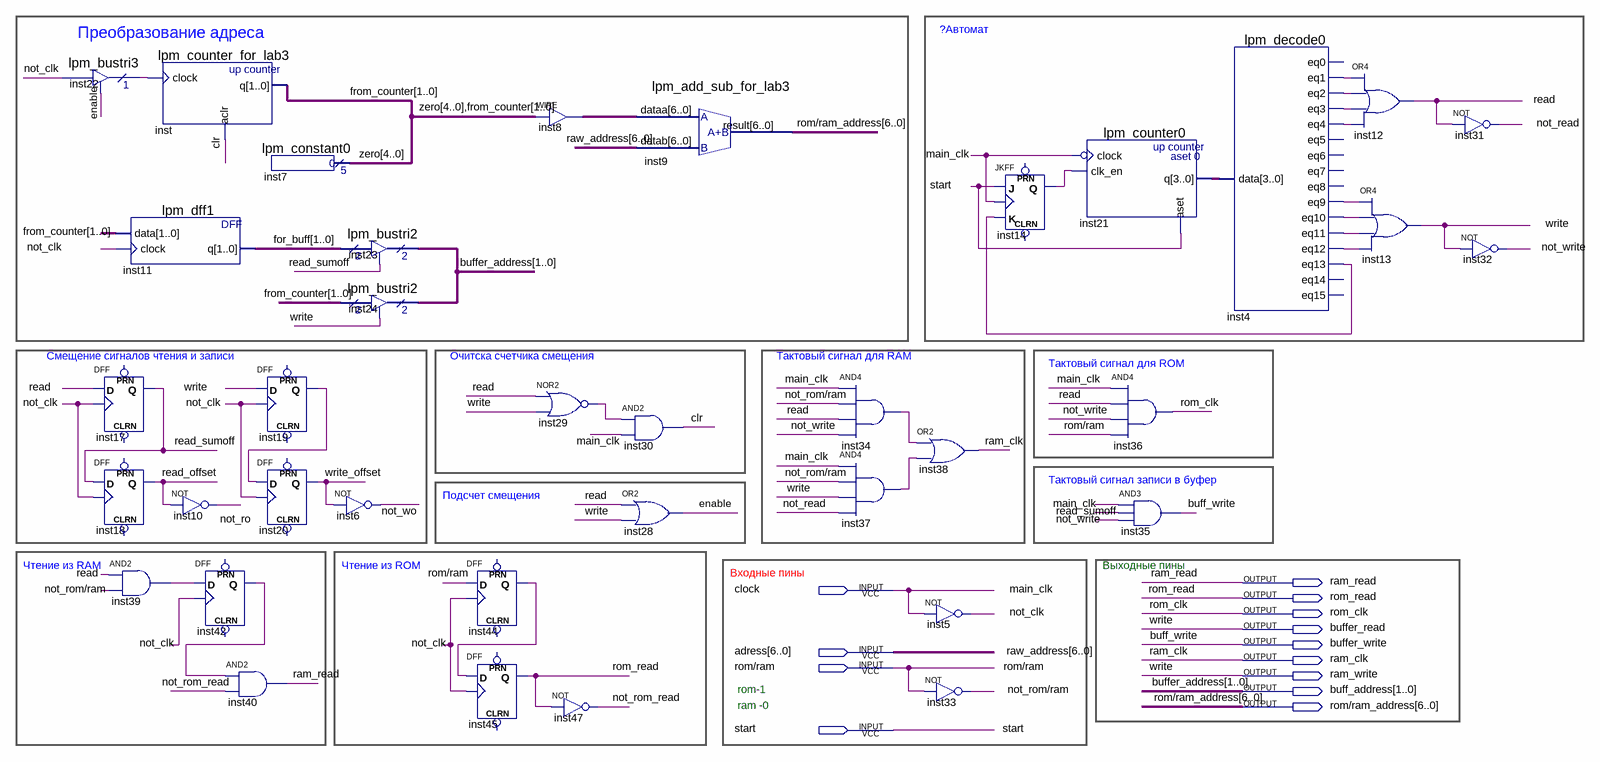
[diagram p0: schematic sheet]
// Quartus schematic new_OI_controller.bdf as structural Verilog: 37 symbols, 13 pins
module new_OI_controller (
  input  clock,
  input  [6:0] adress,
  input  \rom/ram ,
  input  start,
  output ram_read,
  output rom_read,
  output rom_clk,
  output buffer_read,
  output buffer_write,
  output ram_clk,
  output ram_write,
  output [1:0] buff_address,
  output [6:0] \rom/ram_address 
);

  wire clr, enable, inst4_eq1, inst4_eq2, inst4_eq3, inst4_eq4, inst4_eq9, inst4_eq10, inst4_eq11,
       inst4_eq12, inst4_eq13, inst14_q, inst19_q, inst22_tridata, inst29_out, inst34_out, inst37_out,
       inst39_out, inst42_q, inst44_q, not_clk, not_read, not_ro, \not_rom/ram , not_rom_read, not_wo,
       not_write, read, read_offset, read_sumoff, write_offset;
  wire [1:0] for_buff, from_counter;
  wire [3:0] inst21_q;
  wire [4:0] zero;
  wire [6:0] inst8_out;

  lpm_bustri3 inst22 (.enabledt(enable), .data(not_clk), .tridata(inst22_tridata));
  lpm_dff1 inst11 (.data(from_counter), .clock(not_clk), .q(for_buff));
  DFF inst17 (.CLK(not_clk), .D(read), .Q(read_sumoff));  // open: CLRN, PRN
  DFF inst18 (.CLK(not_clk), .D(read_sumoff), .Q(read_offset));  // open: CLRN, PRN
  and inst39 (inst39_out, read, \not_rom/ram );
  lpm_counter_for_lab3 inst (.clock(inst22_tridata), .aclr(clr), .q(from_counter));
  not inst10 (not_ro, read_offset);
  DFF inst42 (.CLK(not_clk), .D(inst39_out), .Q(inst42_q));  // open: CLRN, PRN
  lpm_constant0 inst7 (.result(zero));
  DFF inst19 (.CLK(not_clk), .D(buffer_read), .Q(inst19_q));  // open: CLRN, PRN
  DFF inst20 (.CLK(not_clk), .D(inst19_q), .Q(write_offset));  // open: CLRN, PRN
  and inst40 (ram_read, inst42_q, not_rom_read);
  lpm_bustri2 inst23 (.enabledt(read_sumoff), .data(for_buff), .tridata(buff_address));
  lpm_bustri2 inst24 (.enabledt(buffer_read), .data(from_counter), .tridata(buff_address));
  not inst6 (not_wo, write_offset);
  DFF inst44 (.CLK(not_clk), .D(\rom/ram ), .Q(inst44_q));  // open: CLRN, PRN
  DFF inst45 (.CLK(not_clk), .D(inst44_q), .Q(rom_read));  // open: CLRN, PRN
  assign inst8_out = {zero, from_counter};  // WIRE inst8
  nor inst29 (inst29_out, read, buffer_read);
  not inst47 (not_rom_read, rom_read);
  lpm_add_sub_for_lab3 inst9 (.dataa(inst8_out), .datab(adress), .result(\rom/ram_address ));
  and inst30 (clr, inst29_out, clock);
  or inst28 (enable, read, buffer_read);
  and inst34 (inst34_out, clock, \not_rom/ram , read, not_write);
  and inst37 (inst37_out, clock, \not_rom/ram , buffer_read, not_read);
  or inst38 (ram_clk, inst34_out, inst37_out);
  not inst5 (not_clk, clock);
  not inst33 (\not_rom/ram , \rom/ram );
  JKFF inst14 (.K(inst4_eq13), .J(start), .CLK(clock), .Q(inst14_q));  // open: PRN, CLRN
  lpm_counter0 inst21 (.clock(~clock), .clk_en(inst14_q), .aset(start), .q(inst21_q));
  and inst36 (rom_clk, clock, read, not_write, \rom/ram );
  and inst35 (buffer_write, clock, read_sumoff, not_write);
  lpm_decode0 inst4 (
    .data(inst21_q), .eq1(inst4_eq1), .eq2(inst4_eq2), .eq3(inst4_eq3), .eq4(inst4_eq4), .eq9(inst4_eq9),
    .eq10(inst4_eq10), .eq11(inst4_eq11), .eq12(inst4_eq12), .eq13(inst4_eq13));  // open: eq0, eq5, eq6, eq7, eq8, eq14, eq15
  or inst12 (read, inst4_eq1, inst4_eq2, inst4_eq3, inst4_eq4);
  or inst13 (buffer_read, inst4_eq9, inst4_eq10, inst4_eq11, inst4_eq12);
  not inst31 (not_read, read);
  not inst32 (not_write, buffer_read);

  assign ram_write = buffer_read;

  // Other names for the same wires on the sheet: buff_write = buffer_write; buffer_address[1:0] = buff_address;
  //   main_clk = clock; raw_address[6:0] = adress; write = buffer_read

  // Notes on the sheet:
  //   Преобразование адреса
  //   ?Автомат
  //   Смещение сигналов чтения и записи
  //   Очитска счетчика смещения
  //   Тактовый сигнал для RAM
  //   Тактовый сигнал для ROM
  //   Тактовый сигнал записи в буфер
  //   Подсчет смещения
  //   Чтение из RAM
  //   Чтение из ROM
  //   Выходные пины
  //   Входные пины
  //   rom-1
  //   ram -0
endmodule
